# EAGLE design attenuverter 7-24-22 (EAGLE 9.6.2)
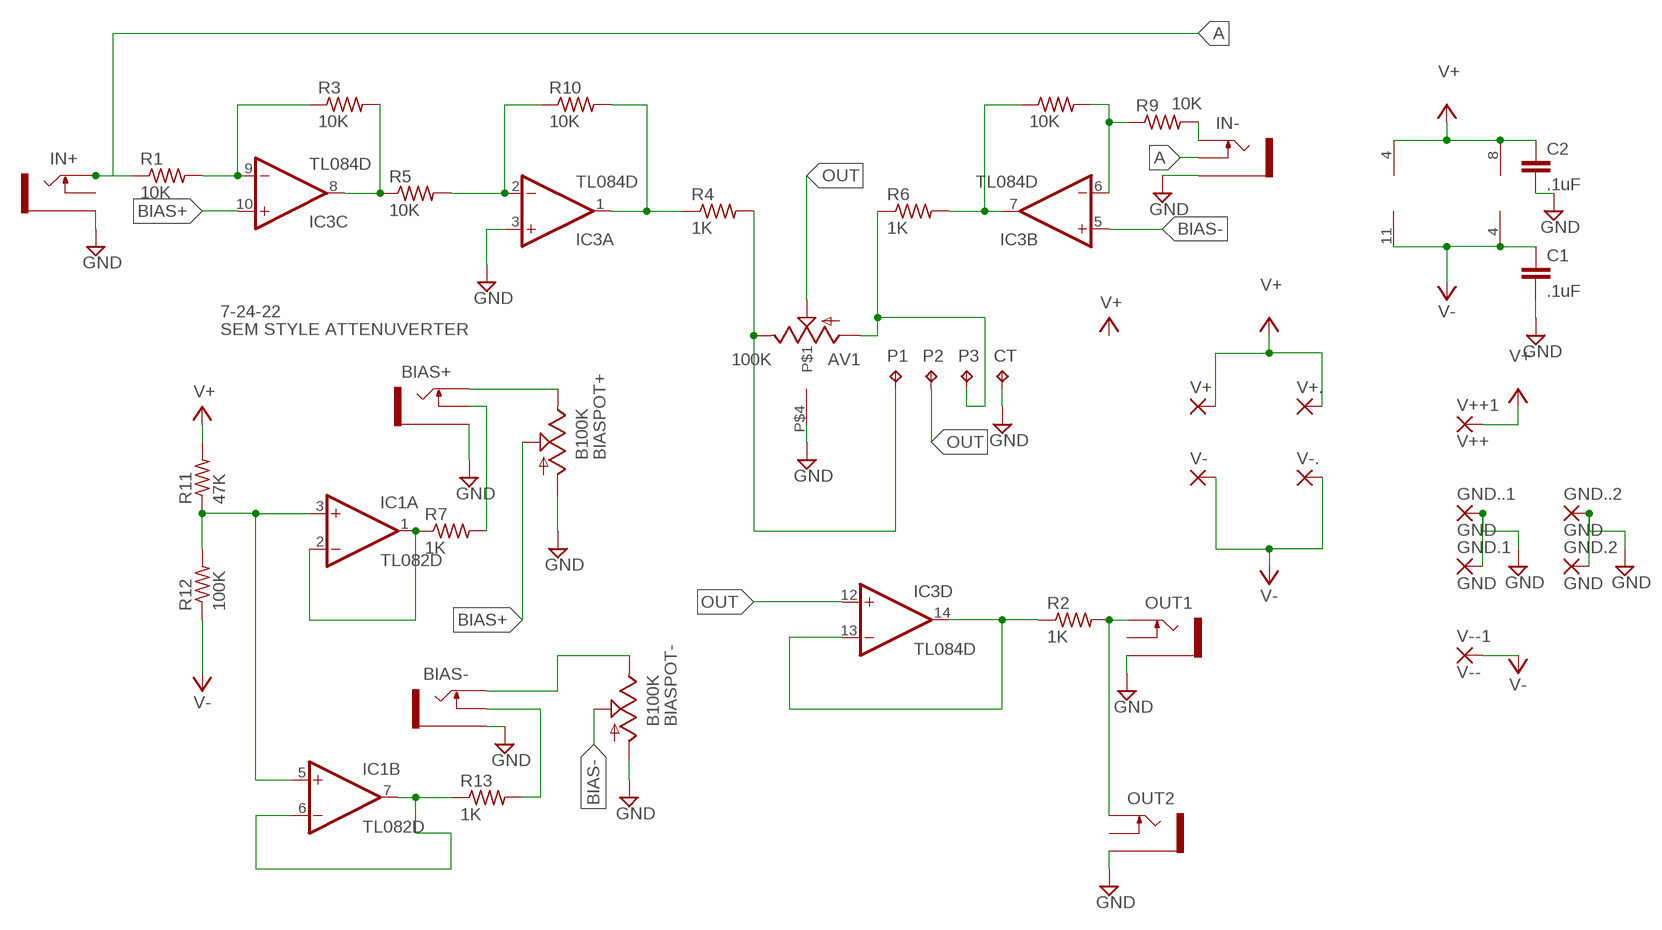
[diagram p0: schematic, sheet 1]

## Parts
AV1  100K  ALPSRK11K114  [ALPSCENTERTAP]
BIAS+  THONKICONNOLD  [THONKICONN]
BIAS-  THONKICONNOLD  [THONKICONN]
BIASPOT+  B100K  9MM_SNAP-IN_POT_  [9MM_SNAP-IN_POT]
BIASPOT-  B100K  9MM_SNAP-IN_POT_  [9MM_SNAP-IN_POT]
C1  .1uF  C5/3.5  [C5B3.5]
C2  .1uF  C5/3.5  [C5B3.5]
CT  TPPAD1-13  [P1-13]
GND.1  GND  1,6/0,8  [1,6/0,8]
GND.2  GND  1,6/0,8  [1,6/0,8]
GND..1  GND  1,6/0,8  [1,6/0,8]
GND..2  GND  1,6/0,8  [1,6/0,8]
IC1  TL082D  [SO08]
IC3  TL084D  [SO14]
IN+  THONKICONNOLD  [THONKICONN]
IN-  THONKICONNOLD  [THONKICONN]
OUT1  THONKICONNOLD  [THONKICONN]
OUT2  THONKICONNOLD  [THONKICONN]
P1  TPPAD1-13  [P1-13]
P2  TPPAD1-13  [P1-13]
P3  TPPAD1-13  [P1-13]
R1  10K  R-US_0204/7  [0204/7]
R2  1K  R-US_0204/7  [0204/7]
R3  10K  R-US_0204/7  [0204/7]
R4  1K  R-US_0204/7  [0204/7]
R5  10K  R-US_0204/7  [0204/7]
R6  1K  R-US_0204/7  [0204/7]
R7  1K  R-US_0204/7  [0204/7]
R8  10K  R-US_0204/7  [0204/7]
R9  10K  R-US_0204/7  [0204/7]
R10  10K  R-US_0204/7  [0204/7]
R11  47K  R-US_0204/7  [0204/7]
R12  100K  R-US_0204/7  [0204/7]
R13  1K  R-US_0204/7  [0204/7]
V+  WIREPAD2,54/1,1  [2,54/1,1]
V++1  V++  1,6/0,8  [1,6/0,8]
V+.  WIREPAD2,54/1,1  [2,54/1,1]
V-  WIREPAD2,54/1,1  [2,54/1,1]
V--1  V--  1,6/0,8  [1,6/0,8]
V-.  WIREPAD2,54/1,1  [2,54/1,1]

## Nets
A: IN+.P$3_TIP(TIP) IN-.P$2_SWITCH(SWITCH) R1.1
BIAS+: BIASPOT+.2(S) IC3.10(C:+IN)
BIAS-: BIASPOT-.2(S) IC3.5(B:+IN)
GND: AV1.P$4 BIAS+.P$1_SLEEVE(SLEEVE) BIAS-.P$1_SLEEVE(SLEEVE) BIASPOT+.1(A) BIASPOT-.1(A) C1.2 C2.2 CT.TP GND.1.1(P) GND.2.1(P) GND..1.1(P) GND..2.1(P) IC3.3(A:+IN) IN+.P$1_SLEEVE(SLEEVE) IN-.P$1_SLEEVE(SLEEVE) OUT1.P$1_SLEEVE(SLEEVE) OUT2.P$1_SLEEVE(SLEEVE)
N$1: IC3.6(B:-IN) R8.2 R9.1
N$2: IC1.3(A:+IN) IC1.5(B:+IN) R11.1 R12.2
N$3: IC3.7(B:OUT) R6.2 R8.1
N$4: IC1.1(A:OUT) IC1.2(A:-IN) R7.1
N$5: AV1.P$1(HIGH) P1.TP R4.2
N$6: IC1.6(B:-IN) IC1.7(B:OUT) R13.1
N$7: BIAS-.P$3_TIP(TIP) BIASPOT-.3(E)
N$8: IN-.P$3_TIP(TIP) R9.2
N$9: BIAS+.P$2_SWITCH(SWITCH) R7.2
N$10: BIAS-.P$2_SWITCH(SWITCH) R13.2
N$11: IC3.9(C:-IN) R1.2 R3.1
N$12: IC3.13(D:-IN) IC3.14(D:OUT) R2.1
N$13: AV1.P$3(LOW) P3.TP R6.1
N$14: BIAS+.P$3_TIP(TIP) BIASPOT+.3(E)
N$16: IC3.8(C:OUT) R3.2 R5.1
N$17: IC3.2(A:-IN) R5.2 R10.1
N$18: IC3.1(A:OUT) R4.1 R10.2
N$20: OUT1.P$3_TIP(TIP) OUT2.P$3_TIP(TIP) R2.2
OUT: AV1.P$2(WIPER) IC3.12(D:+IN) P2.TP
V+: C2.1 IC1.8(P:V+) IC3.4(P:V+) R11.2 V++1.1(P) V+.1(P) V+..1(P)
V-: C1.1 IC1.4(P:V-) IC3.11(P:V-) R12.1 V--1.1(P) V-.1(P) V-..1(P)
Unconnected: IN+.P$2_SWITCH(SWITCH) OUT1.P$2_SWITCH(SWITCH) OUT2.P$2_SWITCH(SWITCH)

## Notes on the sheet
- 7-24-22
- SEM STYLE ATTENUVERTER

## Library data of the parts
AV1 = MusicThingModular-CL:ALPSRK11K114: ALPS Pot with center tap ground
BIAS+ BIAS- IN+ IN- OUT1 OUT2 = MusicThingModular:THONKICONN: 3.5mm socket for Eurorack modular synths
BIASPOT+ BIASPOT- = MusicThingModular:9MM_SNAP-IN_POT: 9mm vertical snap-in pot, Alpha / Panasonic style
C1 C2 = capacitor-wima:C: CAPACITOR naming: grid - package width
CT P1-P3 = testpad-CL:TP: Test pad NO NAME
GND.1 GND.2 GND..1 GND..2 V++1 V--1 = wirepad-NONAMES:1,6/0,8: THROUGH-HOLE PAD
IC1 = linear:TL082: OP AMP Data sheet <http://www.ti.com/lit/ds/symlink/tl084a . pdf>; DATA_SHEET: <a href="http://www.ti.com/lit/ds/symlink/tl084a.pdf"> Data sheet </a>
IC3 = linear:TL084: OP AMP
R1-R13 = rcl:R-US_: RESISTOR, American symbol
V+ V+. V- V-. = wirepad:WIREPAD: Wire PAD connect wire on PCB

## Board
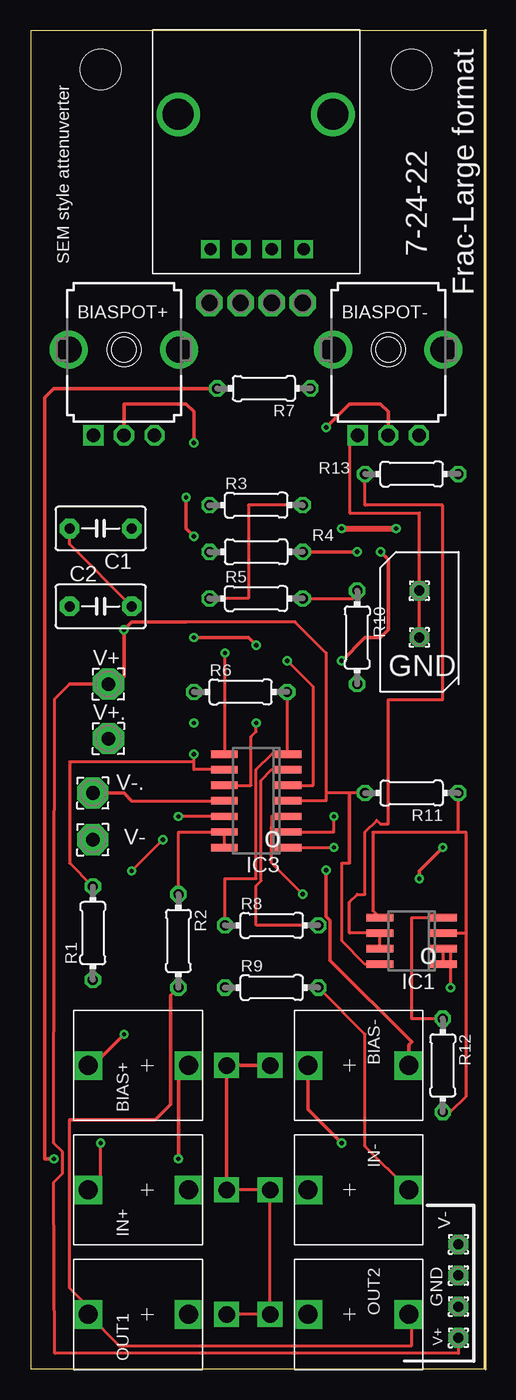
[diagram p1: board, top side]
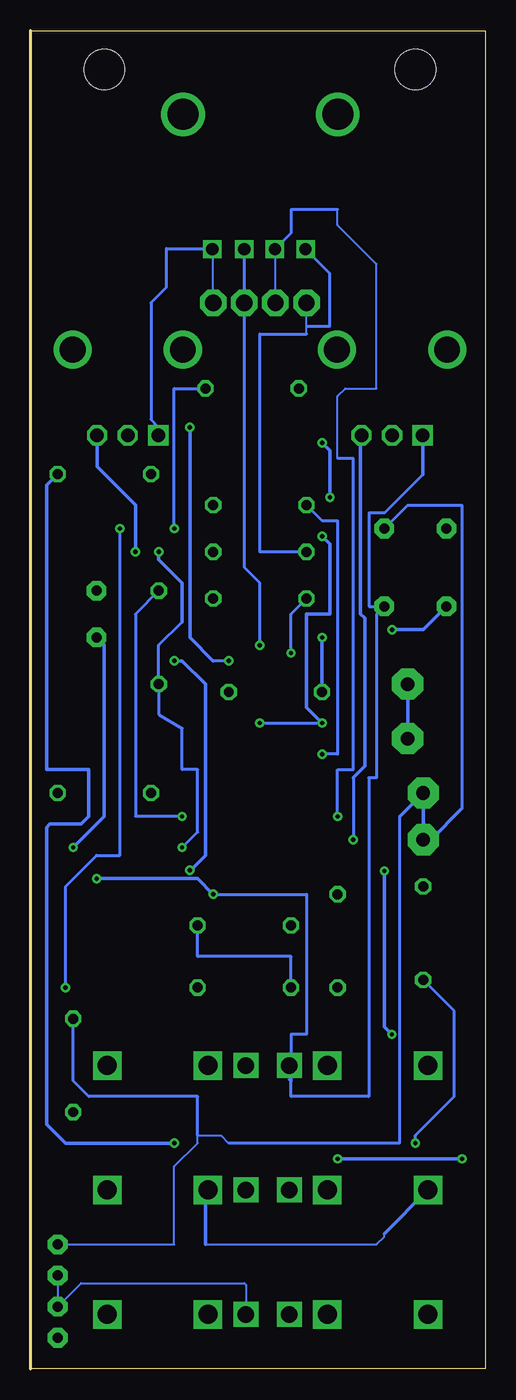
[diagram p2: board, bottom side, seen from below]

Size 37.13 x 109.21 mm. Coordinates in mm from the lower left corner, seen from the top.
Outline: 0,0 37.13,0 37.13,109.21 0,109.21 0,0
Copper layers (1*16): Top 0.035mm / dielectric 1.5mm / Bottom 0.035mm
Design rules "default": minimum track width 6mil, minimum drill 0.35mm, track to track 6mil, track to pad 6mil, pad to pad 6mil, via to via 6mil, smd to smd 6mil, copper to edge 40mil, drill to drill 6mil, minimum pad ring 10mil, minimum via ring 8mil, stop-mask expansion 4mil, vias tented up to drill 0mil, thermal gap 10mil
Holes 3.3 mm at 5.71,106.05 31.11,106.05

### Footprints (pad centres in the part's own frame; a part is rotated, then mirrored left to right if it is on the bottom)
ALPSCENTERTAP = drill 1 square: P$1 10.238,3.746; P$2 12.738,3.746; P$3 15.238,3.746; P$4 17.857,3.746 | drill 2.54: P$5 7.603,14.746; P$6 20.238,14.746
THONKICONN = drill 1.35 square: P$1_SLEEVE 0,-6.48 | drill 1.55 square: P$2_SWITCH 0,-3.38; P$3_TIP 0,4.84
9MM_SNAP-IN_POT = drill 1.1 square: 1 -2.5,-7 | drill 1.1 octagon: 2 0,-7; 3 2.5,-7 | drill 2.1 pad 2.794: CHASSIS1 -4.5,0; CHASSIS2 4.5,0
C5B3.5 = drill 0.813 pad 1.6 octagon: 1 -2.54,0; 2 2.54,0
P1-13 = drill 1.321 pad 2.159 octagon: TP 0,0
1,6/0,8 = drill 0.813 pad 1.6 octagon: 1 0,0
SO08 = smd 0.6 x 2.2: 1 -1.905,-2.6; 2 -0.635,-2.6; 3 0.635,-2.6; 4 1.905,-2.6; 5 1.905,2.6; 6 0.635,2.6; 7 -0.635,2.6; 8 -1.905,2.6
SO14 = smd 0.6 x 2.2: 1 -3.81,-2.6; 2 -2.54,-2.6; 3 -1.27,-2.6; 4 0,-2.6; 5 1.27,-2.6; 6 2.54,-2.6; 7 3.81,-2.6; 8 3.81,2.6; 9 2.54,2.6; 10 1.27,2.6; 11 0,2.6; 12 -1.27,2.6; 13 -2.54,2.6; 14 -3.81,2.6
0204/7 = drill 0.813 octagon: 1 -3.81,0; 2 3.81,0
2,54/1,1 = drill 1.118 pad 2.54 octagon: 1 0,0

### Placement (x,y rotation side)
AV1  4.45,87.63 0 top
BIAS+  9.53,24.77 90 top
BIAS-  26.04,24.77 270 top
BIASPOT+  7.62,83.19 0 top
BIASPOT-  29.21,83.19 0 top
C1  5.71,68.58 180 top
C2  5.71,62.23 0 top
CT  22.23,87 0 top
GND.1  34.92,7.62 90 top
GND.2  31.75,63.5 0 top
GND..1  34.92,5.08 90 top
GND..2  31.75,59.69 0 top
IC1  31.11,34.92 90 top
IC3  18.41,46.35 90 top
IN+  9.53,14.61 90 top
IN-  26.04,14.61 270 top
OUT1  9.53,4.45 90 top
OUT2  26.04,4.45 270 top
P1  14.61,87 0 top
P2  17.14,87 0 top
P3  19.68,87 0 top
R1  5.08,35.56 90 top
R2  12.06,34.92 270 top
R3  18.41,70.48 0 top
R4  18.41,66.67 180 top
R5  18.41,62.87 0 top
R6  17.14,55.24 0 top
R7  19.05,80.01 180 top
R8  19.68,36.2 0 top
R9  19.68,31.11 0 top
R10  26.67,59.69 270 top
R11  31.11,46.99 180 top
R12  33.66,24.77 270 top
R13  31.11,73.03 0 top
V+  6.35,55.88 0 top
V++1  34.92,2.54 90 top
V+.  6.35,51.44 0 top
V-  5.08,46.99 0 top
V--1  34.92,10.16 90 top
V-.  5.08,43.18 0 top

### Tracks (layer width: path | path; a pad name or v marks a point on that pad's centre or on a via)
A  (via drill 0.35)
  Top 0.254: IN+.P$3_TIP 5.71,15.63 v5.71,18.41
  Bottom 0.152: 8.26,11.04 8.26,10.79 8.89,10.16 22.86,10.16
  Bottom 0.254: v5.71,18.41 5.71,19.05 2.54,22.23 2.54,29.21 R1.1
  Bottom 0.305: 8.26,11.04 IN+.P$3_TIP | IN-.P$2_SWITCH 22.86,14.4 22.86,10.16
BIAS+  (via drill 0.35)
  Top 0.254: IC3.10 18.01,47.62 18.01,51.6 18.41,52.01 v18.41,52.7
  Top 0.305: v13.34,67.94 12.7,68.58 v12.7,71.12 | v13.34,75.56 13.34,78.11 12.7,78.74 7.62,78.74 BIASPOT+.2
  Bottom 0.254: v18.41,52.7 v13.34,52.7
  Bottom 0.305: v13.34,52.7 14.61,53.98 14.61,61.59 12.7,61.59 12.7,67.31 v13.34,67.94 | v12.7,71.12 12.7,74.93 v13.34,75.56
BIAS-  (via drill 0.35)
  Top 0.254: IC3.5 23.09,47.62 23.09,55.65 v20.95,57.78
  Top 0.305: v24.13,76.83 26.04,78.74 28.57,78.74 29.21,78.11 BIASPOT-.2
  Bottom 0.254: v20.95,57.78 22.23,57.78
  Bottom 0.305: 22.23,57.78 24.13,59.69 v24.13,76.83
GND  (via drill 0.35)
  Top 0.254: IN+.P$1_SLEEVE IN-.P$1_SLEEVE OUT2.P$1_SLEEVE OUT1.P$1_SLEEVE | IC3.3 19.68,45.09 19.68,44.28 19.64,44.23 19.64,41.32 v22.23,38.73 | GND..2.1 GND.2.1 31.75,69.85 26.04,69.85 26.04,75.51 BIASPOT-.1 | C2.2 3.17,67.31 C1.2
  Top 0.305: IN+.P$1_SLEEVE BIAS+.P$1_SLEEVE 19.05,24.77 19.68,24.13 19.68,24.64 BIAS-.P$1_SLEEVE | v31.75,40.01 31.75,40.64 v33.66,42.55
  Bottom 0.152: GND.1.1 GND..1.1 33.02,6.99 19.68,6.99 19.55,6.86 OUT2.P$1_SLEEVE | CT.TP 22.23,91.3 AV1.P$4
  Bottom 0.254: v22.23,38.73 14.61,38.73 14.61,27.3 15.88,27.3 15.88,23.5 | 15.88,23.5 16,23.62 BIAS+.P$1_SLEEVE | AV1.P$4 25.97,91.38 26.04,91.44 26.04,88.27 27.3,87 27.3,77.47 26.71,76.88 BIASPOT-.1 | 15.88,23.5 15.88,22.23 9.53,22.23 9.53,48.26 8.89,48.26 8.89,61.59 C2.2 9.5,62.23 9.5,69.85 8.26,69.85 5.12,72.98
  Bottom 0.305: 5.12,72.98 BIASPOT+.1 | v22.23,38.73 23.5,40.01 v31.75,40.01 | v33.66,42.55 31.11,45.09 31.11,59.05 GND..2.1
N$1
  Top 0.254: R8.2 18.41,36.2 18.41,39.43 18.82,39.84 18.82,48.03 19.68,48.9 IC3.6
  Bottom 0.254: R9.1 15.88,33.66 23.5,33.66 R8.2
N$2
  Top 0.254: IC1.3 35.56,35.56 | 35.56,35.56 35.56,43.81 34.92,43.81 | 34.92,43.81 R11.1 | IC1.5 27.94,37.41 27.94,43.81 34.92,43.81 | R12.2 34.29,20.95 35.56,22.23 35.56,35.56
N$3
  Top 0.254: IC3.7 20.98,50.2 | 20.98,50.2 20.95,50.23 R6.2 | R8.1 15.88,40.01 18.41,40.01 18.41,48.9 19.71,50.2 20.98,50.2
N$4  (via drill 0.35)
  Top 0.254: IC1.1 IC1.2 34.29,34.29 v34.29,31.11
  Top 0.508: v25.4,68.58 v29.84,68.58
  Bottom 0.254: R7.1 25.4,80.01 v25.4,68.58 | v34.29,31.11 34.29,39.37 31.75,41.91 29.84,41.91 v29.84,68.58
N$5
  Bottom 0.152: 14.61,84.45 14.61,85.09 P1.TP
  Bottom 0.254: R4.2 18.41,66.67 18.41,84.45 14.61,84.45 | 14.61,85.09 12.7,85.09 12.7,89.39 AV1.P$1
N$6
  Top 0.254: IC1.7 IC1.6 26.04,35.56 26.04,38.1 26.67,38.73 27.3,38.73 27.3,43.81 28.26,44.77 28.57,44.45 29.21,44.45 29.21,54.61 33.66,54.61 33.66,70.48 27.3,70.48 R13.1
N$7  (via drill 0.35)
  Top 0.305: BIAS-.P$3_TIP 30.88,26.43 31.11,26.67 24.46,33.33 24.46,36.59 24.13,36.92 v24.13,40.69 | v25.4,57.78 27.3,59.69 28.57,59.69 29.21,60.33 29.21,66.04 v28.57,66.67
  Bottom 0.305: v24.13,40.69 24.08,40.69 22.86,41.91 22.86,55.88 24.77,57.78 v25.4,57.78 | v28.57,66.67 28.57,70.48 31.71,73.62 BIASPOT-.3
N$8
  Top 0.254: IN-.P$3_TIP 27.3,18.18 27.3,27.3 R9.2
N$9  (via drill 0.35)
  Top 0.305: R7.2 1.91,80.01 1.17,79.27 1.17,17.14 v1.91,17.14 | v12.06,17.14 12.06,23.93 BIAS+.P$2_SWITCH
  Bottom 0.305: v1.91,17.14 v12.06,17.14
N$10  (via drill 0.35)
  Top 0.305: v25.4,18.41 22.66,21.16 BIAS-.P$2_SWITCH
  Bottom 0.305: R13.2 35.84,72.11 35.84,48.9 32.38,48.9 32.38,45.09 33.02,44.45 35.56,44.45 35.84,44.17 35.84,19.96 34.29,18.41 v25.4,18.41
N$11  (via drill 0.35)
  Top 0.254: IC3.9 13.34,48.9 13.34,49.53 | 13.34,49.53 3.17,49.53 3.17,41.27 R1.2 | 13.34,49.53 v13.34,50.16
  Bottom 0.254: v13.34,50.16 12.06,50.16 12.06,69.22 13.34,69.22 R3.1
N$12
  Top 0.254: IC3.14 IC3.13 12.06,43.81 R2.1
N$13  (via drill 0.35)
  Top 0.305: v18.41,59.05 17.78,59.69 v13.34,59.69
  Bottom 0.152: P3.TP AV1.P$3
  Bottom 0.254: v18.41,59.05 18.41,64.14 19.68,65.41 AV1.P$3
  Bottom 0.305: v13.34,59.69 R6.1
N$14  (via drill 0.35)
  Top 0.254: v10.79,43.18 v8.26,40.64
  Top 0.305: v7.64,27.3 5.1,24.77 BIAS+.P$3_TIP
  Bottom 0.254: 10.77,48.24 10.77,43.2 v10.79,43.18
  Bottom 0.305: 10.77,48.24 10.79,48.26 9.84,49.21 9.84,61.28 10.19,61.62 10.19,76.12 BIASPOT+.3 | v8.26,40.64 8.26,27.92 v7.64,27.3
N$16  (via drill 0.35)
  Top 0.254: R3.2 17.78,70.48 17.78,62.87 R5.1 | IC3.8 15.88,50.23 v15.88,58.42
  Bottom 0.254: R5.1 15.88,61.59 v15.88,58.42
N$17  (via drill 0.35)
  Top 0.254: R5.2 26.35,62.87 R10.1 | IC3.2 24.77,43.81 v24.77,45.09
  Bottom 0.254: v24.77,45.09 28.57,45.09 28.57,61.59 R10.1
N$18  (via drill 0.35)
  Top 0.254: IC3.1 v24.77,42.55
  Top 0.305: v26.67,66.67 R4.1
  Bottom 0.254: v24.77,42.55 23.5,43.81 23.5,48.9 24.77,48.9 24.77,52.27 26.67,53.42 R10.2 26.67,59.05 24.77,60.96
  Bottom 0.305: 24.77,60.96 24.77,64.14 26.67,66.04 v26.67,66.67
N$20
  Top 0.254: 3.17,20.32 3.17,6.59 4.68,5.08 OUT1.P$3_TIP 7.22,1.91 31.11,1.91 31.11,4.21 OUT2.P$3_TIP | 11.43,30.48 R2.2
  Top 0.305: 3.17,20.32 10.16,20.32 11.43,21.59 11.43,30.48
OUT  (via drill 0.35)
  Top 0.254: IC3.12 v12.06,45.09
  Bottom 0.152: AV1.P$2 17.18,87.03 P2.TP | 12.06,74.3 12.06,79.38 11.43,80.01 8.89,80.01 8.89,90.17 12.06,93.34 12.06,94.61
  Bottom 0.254: 12.06,94.61 15.88,94.61 15.88,92.68 AV1.P$2 | 12.06,74.3 10.79,74.3 10.79,48.9 12.06,48.9 v12.06,45.09
V+  (via drill 0.35)
  Top 0.254: IC1.8 27.3,33.02 25.4,34.92 25.4,41.27 26.04,41.27 | 12.7,60.96 21.59,60.96 24.13,58.42 24.13,46.99 | R11.2 26.04,46.99 24.13,46.99 | IC3.4 24.13,46.35 24.13,46.99 | V++1.1 34.92,1.27 1.98,1.27 1.91,15.24 2.62,15.95 2.62,17.7 1.91,18.41 1.98,54.69 3.17,55.88
  Top 0.305: 26.04,41.27 26.04,46.99 | 12.7,60.96 8.26,60.96 v7.62,60.33 7.62,56.52 6.99,56.52 V+.1 3.17,55.88
  Bottom 0.305: v7.62,60.33 5.08,60.33 C2.1 | V+..1 V+.1
V-
  Top 0.254: R12.1 31.11,28.57 31.11,36.83 IC1.4 | 8.26,46.35 IC3.11
  Top 0.305: V-.1 7.62,46.99 8.26,46.35
  Bottom 0.152: V--1.1 25.4,10.16 25.4,16.51 23.5,18.41 23.5,19.05 21.59,19.05 20.95,18.41
  Bottom 0.254: 1.91,45.72 1.91,70.48 6.35,70.48 C1.1 | 6.99,45.09 6.99,18.41 20.95,18.41 | 23.5,19.05 23.5,22.23 32.38,22.23 33.66,23.5 R12.1
  Bottom 0.305: 1.91,45.72 4.45,43.18 V-..1 V-.1 6.99,45.09

### Text on the board
tNames: 7-24-22 | SEM style attenuverter | Frac-Large format | GND | o | o | V- | GND | V+